# Altium project EEG.PrjPcb
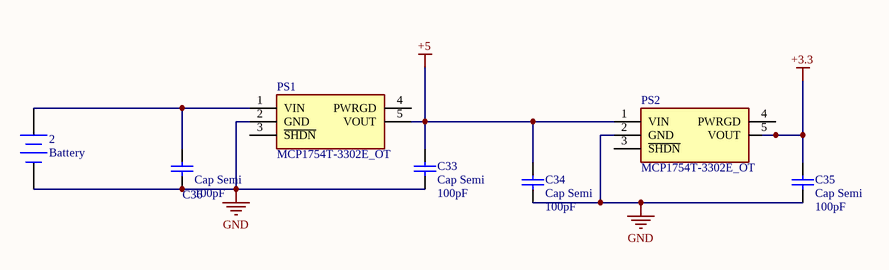
[diagram p0: Power.SchDoc]
1 sheet, 7 parts. Net scope: global (net labels, ports and power ports of the same name join across sheets).
Board file: PCB3.PcbDoc

## Sheet Power.SchDoc
size A

### Parts
2  Battery  [BAT-2]
C33  Cap Semi  value 100pF  [0805c]
C34  Cap Semi  value 100pF  [0805c]
C35  Cap Semi  value 100pF  [0805c]
C36  Cap Semi  value 100pF  [0805c]
PS1  MCP1754T-3302E_OT  [SOT23-5]
PS2  MCP1754T-3302E_OT  [SOT23-5]

### Nets
+3.3: C35.1 PS2.5(VOUT)
+5: C33.1 C34.2 PS1.5(VOUT) PS2.1(VIN)
GND: 2.2(-) C33.2 C34.1 C35.2 C36.1 PS1.2(GND) PS2.2(GND)
Net2_1: 2.1(+) C36.2 PS1.1(VIN)

Not connected (* = marked no-connect by the designer): PS1 3(~{SHDN}) 4(PWRGD); PS2 3(~{SHDN}) 4(PWRGD)

### Library data of the parts
2 = Battery: Multicell Battery; Published: 24-Mar-1999; LatestRevisionDate: 17-Jul-2002; LatestRevisionNote: Re-released for DXP Platform.; PackageReference: BAT-2; Publisher: Altium Limited; PackageDescription: Battery; 2 Leads
C33-C36 = Cap Semi: Capacitor (Semiconductor SIM Model); Published: 8-Jun-2000; PackageReference: C1206; Publisher: Altium Limited; PackageDescription: Chip Capacitor; LatestRevisionDate: 29-May-2009; LatestRevisionNote: IPC-7351 Footprint Added.
PS1 PS2 = MCP1754T-3302E_OT: Power Supply; Manufacturer_Name: Microchip; Manufacturer_Part_Number: MCP1754T-3302E/OT; Allied_Number: 70451943; Datasheet Link: http://ww1.microchip.com/downloads/en/DeviceDoc/20002276C.pdf; Height: 1.45mm; Mouser Part Number: 579-MCP1754T3302EOT; Mouser Price/Stock: https://www.mouser.com/Search/Refine.aspx?Keyword=579-MCP1754T3302EOT; Allied Price/Stock: https://www.alliedelec.com/microchiptechnologyinc-mcp1754t-3302e-ot/70451943/